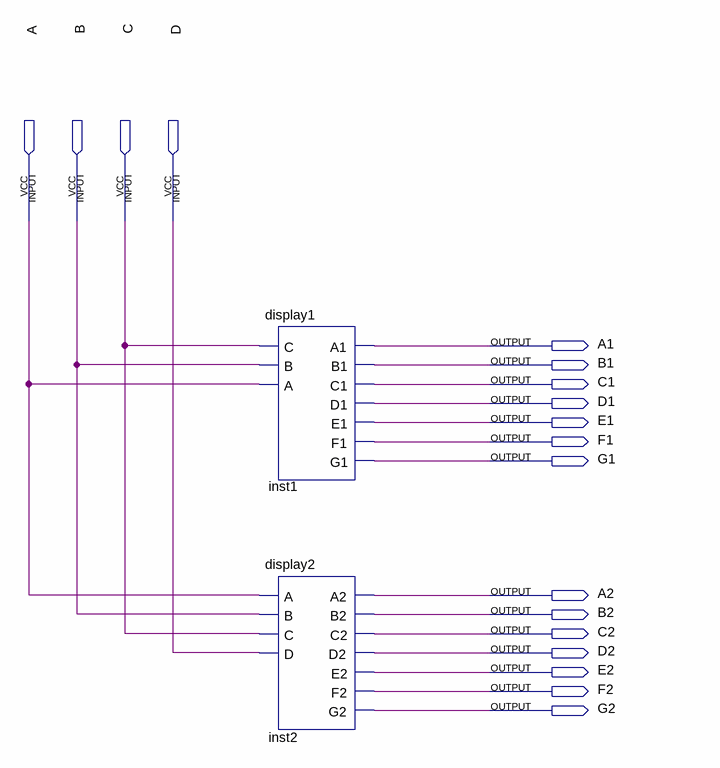
[diagram p0: schematic sheet]
// Quartus schematic decode.bdf as structural Verilog: 2 symbols, 18 pins
module decode (
  input  A,
  input  B,
  input  C,
  input  D,
  output A1,
  output B1,
  output C1,
  output D1,
  output E1,
  output F1,
  output G1,
  output A2,
  output B2,
  output C2,
  output D2,
  output E2,
  output F2,
  output G2
);

  display1 inst1 (.C(C), .B(B), .A(A), .A1(A1), .B1(B1), .C1(C1), .D1(D1), .E1(E1), .F1(F1), .G1(G1));
  display2 inst2 (.A(A), .B(B), .C(C), .D(D), .A2(A2), .B2(B2), .C2(C2), .D2(D2), .E2(E2), .F2(F2), .G2(G2));
endmodule
